# EAGLE design amica (EAGLE 7.6.0)
PROJECT_NAME: AmiCA USB-PD power supply
Assembly variants: LaptopPack, USB-PD
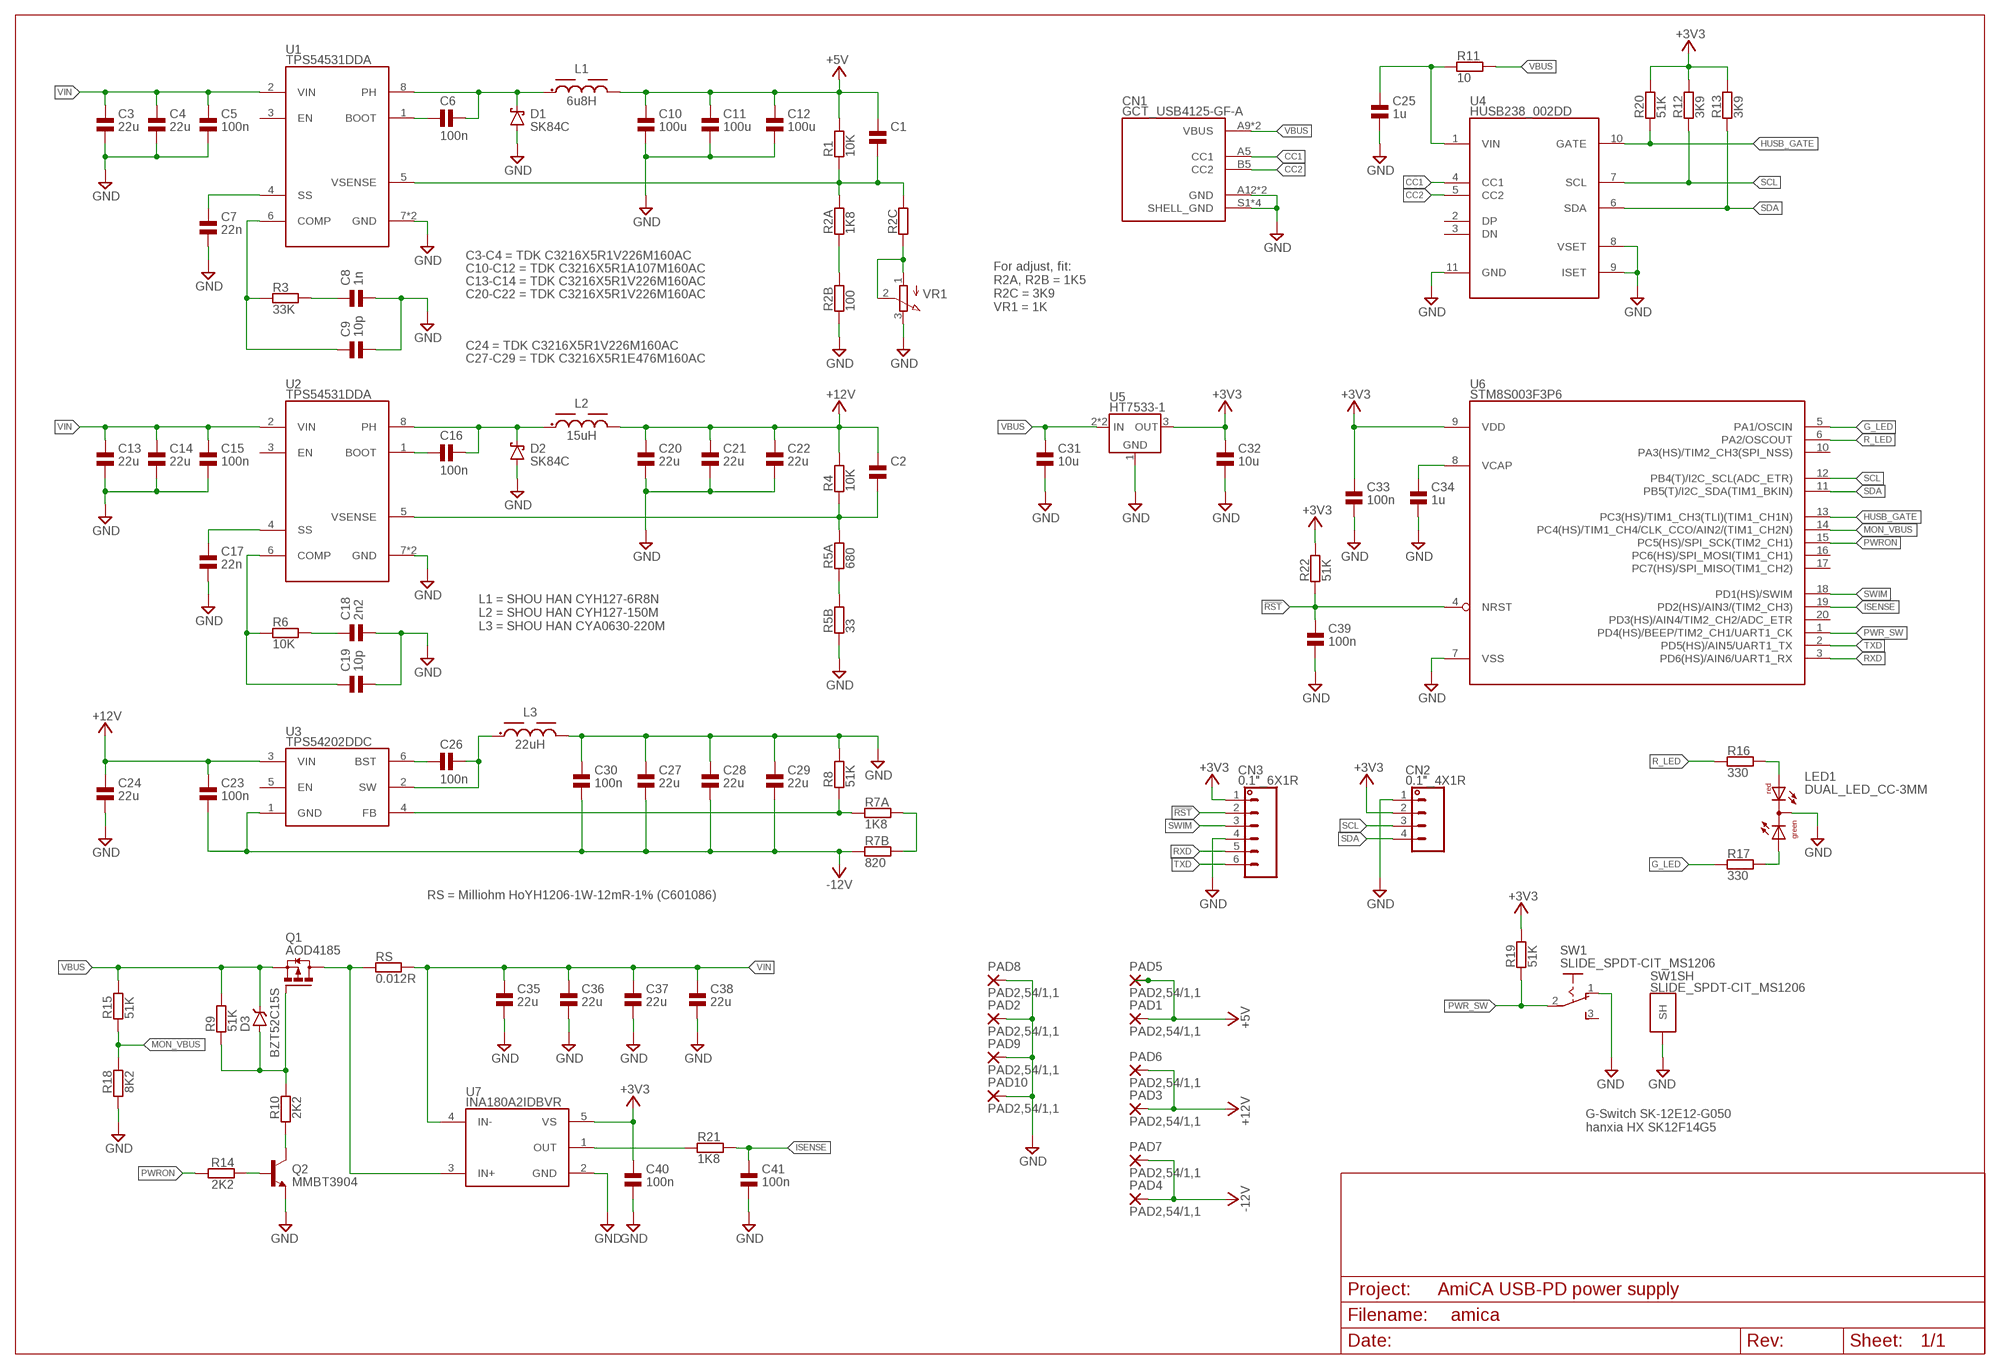
[diagram p0: schematic, sheet 1]

## Parts
C1  CAP_NPOL-0603  [0603]
C2  CAP_NPOL-0603  [0603]
C3  22u  CAP_NPOL-1206  [1206]
C4  22u  CAP_NPOL-1206  [1206]
C5  100n  CAP_NPOL-0603  [0603]
C6  100n  CAP_NPOL-0603  [0603]
C7  22n  CAP_NPOL-0603  [0603]
C8  1n  CAP_NPOL-0603  [0603]
C9  10p  CAP_NPOL-0603  [0603]
C10  100u  CAP_NPOL-1206  [1206]
C11  100u  CAP_NPOL-1206  [1206]
C12  100u  CAP_NPOL-1206  [1206]
C13  22u  CAP_NPOL-1206  [1206]
C14  22u  CAP_NPOL-1206  [1206]
C15  100n  CAP_NPOL-0603  [0603]
C16  100n  CAP_NPOL-0603  [0603]
C17  22n  CAP_NPOL-0603  [0603]
C18  2n2  CAP_NPOL-0603  [0603]
C19  10p  CAP_NPOL-0603  [0603]
C20  22u  CAP_NPOL-1206  [1206]
C21  22u  CAP_NPOL-1206  [1206]
C22  22u  CAP_NPOL-1206  [1206]
C23  100n  CAP_NPOL-0603  [0603]
C24  22u  CAP_NPOL-1206  [1206]
C25  1u  CAP_NPOL-0603  [0603]  (not fitted in variant LaptopPack)
C26  100n  CAP_NPOL-0603  [0603]
C27  22u  CAP_NPOL-1206  [1206]
C28  22u  CAP_NPOL-1206  [1206]
C29  22u  CAP_NPOL-1206  [1206]
C30  100n  CAP_NPOL-0603  [0603]
C31  10u  CAP_NPOL-0805  [0805]
C32  10u  CAP_NPOL-0603  [0603]
C33  100n  CAP_NPOL-0603  [0603]
C34  1u  CAP_NPOL-0603  [0603]
C35  22u  CAP_NPOL-1206  [1206]
C36  22u  CAP_NPOL-1206  [1206]
C37  22u  CAP_NPOL-1206  [1206]
C38  22u  CAP_NPOL-1206  [1206]
C39  100n  CAP_NPOL-0603  [0603]
C40  100n  CAP_NPOL-0603  [0603]
C41  100n  CAP_NPOL-0603  [0603]
CN1  GCT_USB4125-GF-A  USB-C-6P_GCT_USB4125-GF-A  [GCT_USB4125-GF-A-0190_REVA2]
CN2  0.1"_4X1R  [0.1"_4X1-ROUND]
CN3  0.1"_6X1R  [0.1"_6X1-ROUND]
D1  SK84C  -SHOTTKY_SMC  [SMC]
D2  SK84C  -SHOTTKY_SMC  [SMC]
D3  BZT52C15S  -ZENER_SOD323F  [SOD323F]
L1  6u8H  L-SHOUHAN_CYH125  [SHOUHAN_CYH125]
L2  15uH  L-SHOUHAN_CYH125  [SHOUHAN_CYH125]
L3  22uH  L-SHOUHAN_CYA0630  [SHOUHAN_CYA0630]
LED1  DUAL_LED_CC-3MM  [DUOLED-3MM]
PAD1  PAD2,54/1,1  [2,54/1,1]
PAD2  PAD2,54/1,1  [2,54/1,1]
PAD3  PAD2,54/1,1  [2,54/1,1]
PAD4  PAD2,54/1,1  [2,54/1,1]
PAD5  PAD2,54/1,1  [2,54/1,1]
PAD6  PAD2,54/1,1  [2,54/1,1]
PAD7  PAD2,54/1,1  [2,54/1,1]
PAD8  PAD2,54/1,1  [2,54/1,1]
PAD9  PAD2,54/1,1  [2,54/1,1]
PAD10  PAD2,54/1,1  [2,54/1,1]
Q1  AOD4185  -PMOS_DPAK  [DPAK]
Q2  MMBT3904  -NPN_SOT23  [SOT23]
R1  10K  RES-SMD_0603  [0603]
R2A  1K8  RES-SMD_0603  [0603]
R2B  100  RES-SMD_0603  [0603]
R2C  RES-SMD_0603  [0603]
R3  33K  RES-SMD_0603  [0603]
R4  10K  RES-SMD_0603  [0603]
R5A  680  RES-SMD_0603  [0603]
R5B  33  RES-SMD_0603  [0603]
R6  10K  RES-SMD_0603  [0603]
R7A  1K8  RES-SMD_0603  [0603]
R7B  820  RES-SMD_0603  [0603]
R8  51K  RES-SMD_0603  [0603]
R9  51K  RES-SMD_0603  [0603]
R10  2K2  RES-SMD_0603  [0603]
R11  10  RES-SMD_0805  [0805]  (not fitted in variant LaptopPack)
R12  3K9  RES-SMD_0603  [0603]
R13  3K9  RES-SMD_0603  [0603]
R14  2K2  RES-SMD_0603  [0603]
R15  51K  RES-SMD_0603  [0603]
R16  330  RES-SMD_0603  [0603]
R17  330  RES-SMD_0603  [0603]
R18  8K2  RES-SMD_0603  [0603]
R19  51K  RES-SMD_0603  [0603]
R20  51K  RES-SMD_0603  [0603]
R21  1K8  RES-SMD_0603  [0603]
R22  51K  RES-SMD_0603  [0603]
RS  0.012R  RES-SMD_1206  [1206]
SW1  SLIDE_SPDT-CIT_MS1206  [CIT_MS1206]
U1  TPS54531DDA  [SO08-EP]
U2  TPS54531DDA  [SO08-EP]
U3  TPS54202DDC  [SOT23-6]
U4  HUSB238_002DD  [DFN10-3X3]  (not fitted in variant LaptopPack)
U5  HT7533-1  [SOT89]
U6  STM8S003F3P6  [TSSOP20]
U7  INA180A2IDBVR  INA180A2DBV  [SOT23-5]
VR1  TRIMMER-BOURNS_3362P  [TRIM_3362P-1]

## Nets
5V_BST: C6.1 U1.1(BOOT)
5V_COMP: C9.1 R3.1 U1.6(COMP)
5V_FB: C1.2 R1.1 R2A.2 R2C.2 U1.5(VSENSE)
5V_SS: C7.1 U1.4(SS)
5V_SW: C6.2 D1.K(C) L1.P$1 U1.8(PH)
12V_BST: C16.1 U2.1(BOOT)
12V_COMP: C19.1 R6.1 U2.6(COMP)
12V_FB: C2.2 R4.1 R5A.2 U2.5(VSENSE)
12V_SS: C17.1 U2.4(SS)
12V_SW: C16.2 D2.K(C) L2.P$1 U2.8(PH)
!RST: C39.1 CN3.2 R22.1 U6.4(NRST)
+3V3: C32.1 C33.1 C40.1 CN2.2 CN3.1 R12.2 R13.2 R19.2 R20.2 R22.2 U5.3(OUT) U6.9(VDD) U7.5(VS)
+5V: C1.1 C10.1 C11.1 C12.1 L1.P$2 PAD1.1(P) PAD5.1(P) R1.2
+12V: C2.1 C20.1 C21.1 C22.1 C23.1 C24.1 L2.P$2 PAD3.1(P) PAD6.1(P) R4.2 U3.3(VIN)
-12V: C23.2 C27.2 C28.2 C29.2 C30.2 PAD4.1(P) PAD7.1(P) R7B.1 U3.1(GND)
-12V_BST: C26.1 U3.6(BST)
-12V_FB: R7A.1 R8.1 U3.4(FB)
-12V_SW: C26.2 L3.P$1 U3.2(SW)
CC1: CN1.A5(CC1) U4.4(CC1)
CC2: CN1.B5(CC2) U4.5(CC2)
G_LED: R17.1 U6.5(PA1/OSCIN)
GND: C3.2 C4.2 C5.2 C7.2 C8.2 C9.2 C10.2 C11.2 C12.2 C13.2 C14.2 C15.2 C17.2 C18.2 C19.2 C20.2 C21.2 C22.2 C24.2 C25.2 C27.1 C28.1 C29.1 C30.1 C31.2 C32.2 C33.2 C34.2 C35.2 C36.2 C37.2 C38.2 C39.2 C40.2 C41.2 CN1.A12(GND) CN1.B12(GND) CN1.S1(SHELL_GND) CN1.S2(SHELL_GND) CN1.S3(SHELL_GND) CN1.S4(SHELL_GND) CN2.1 CN3.4 D1.A D2.A L3.P$2 LED1.COM(C) PAD2.1(P) PAD8.1(P) PAD9.1(P) PAD10.1(P) Q2.2(E) R2B.1 R5B.1 R8.2 R18.2 SW1.1(O) SW1.GND@1(SH) SW1.GND@2(SH) U1.7(GND) U1.PAD(GND) U2.7(GND) U2.PAD(GND) U4.8(VSET) U4.9(ISET) U4.11(GND) U5.1(GND) U6.7(VSS) U7.2(GND) VR1.3(CW)
HUSB_GATE: R20.1 U4.10(GATE) U6.13(PC3(HS)/TIM1_CH3(TLI)(TIM1_CH1N))
HUSB_VIN: C25.1 R11.1 U4.1(VIN)
ISENSE: C41.1 R21.2 U6.19(PD2(HS)/AIN3/(TIM2_CH3))
MON_VBUS: R15.1 R18.1 U6.14(PC4(HS)/TIM1_CH4/CLK_CCO/AIN2/(TIM1_CH2N))
N$1: D3.A Q1.1(G) R9.1 R10.1
N$2: LED1.2(AR) R16.2
N$3: R2A.1 R2B.2
N$4: R2C.1 VR1.1(CCW) VR1.2(W)
N$5: C18.1 R6.2
N$6: C34.1 U6.8(VCAP)
N$7: LED1.1(AG) R17.2
N$8: Q2.1(B) R14.1
N$9: R5A.1 R5B.2
N$10: C8.1 R3.2
N$11: R21.1 U7.1(OUT)
N$12: R7A.2 R7B.2
N$13: Q2.3(C) R10.2
PWR_SW: R19.1 SW1.2(P) U6.1(PD4(HS)/BEEP/TIM2_CH1/UART1_CK)
PWRON: R14.2 U6.15(PC5(HS)/SPI_SCK(TIM2_CH1))
R_LED: R16.1 U6.6(PA2/OSCOUT)
RXD: CN3.5 U6.3(PD6(HS)/AIN6/UART1_RX)
SCL: CN2.3 R12.1 U4.7(SCL) U6.12(PB4(T)/I2C_SCL(ADC_ETR))
SDA: CN2.4 R13.1 U4.6(SDA) U6.11(PB5(T)/I2C_SDA(TIM1_BKIN))
SWIM: CN3.3 U6.18(PD1(HS)/SWIM)
TXD: CN3.6 U6.2(PD5(HS)/AIN5/UART1_TX)
VBUS: C31.1 CN1.A9(VBUS) CN1.B9(VBUS) D3.C Q1.3(S) R9.2 R11.2 R15.2 U5.2(IN) U5.2@1(IN)
VBUS_SW: Q1.4(D) RS.1 U7.3(IN+)
VIN: C3.1 C4.1 C5.1 C13.1 C14.1 C15.1 C35.1 C36.1 C37.1 C38.1 RS.2 U1.2(VIN) U2.2(VIN) U7.4(IN-)
Unconnected: SW1.3(S) U1.3(EN) U2.3(EN) U3.5(EN) U4.2(DP) U4.3(DN) U6.10(PA3(HS)/TIM2_CH3(SPI_NSS)) U6.16(PC6(HS)/SPI_MOSI(TIM1_CH1)) U6.17(PC7(HS)/SPI_MISO(TIM1_CH2)) U6.20(PD3(HS)/AIN4/TIM2_CH2/ADC_ETR)

## Notes on the sheet
- C3-C4 = TDK C3216X5R1V226M160AC
- C10-C12 = TDK C3216X5R1A107M160AC
- C13-C14 = TDK C3216X5R1V226M160AC
- C20-C22 = TDK C3216X5R1V226M160AC
- For adjust, fit:
  R2A, R2B = 1K5
  R2C = 3K9
  VR1 = 1K
- C24 = TDK C3216X5R1V226M160AC
- C27-C29 = TDK C3216X5R1E476M160AC
- L1 = SHOU HAN CYH127-6R8N
  L2 = SHOU HAN CYH127-150M
  L3 = SHOU HAN CYA0630-220M
- RS = Milliohm HoYH1206-1W-12mR-1% (C601086)
- G-Switch SK-12E12-G050
  hanxia HX SK12F14G5

## Library data of the parts
C1 C2 = jc-passive:CAP_NPOL
C3 C4 C13 C14 C20-C22 C24 C27-C29 C35-C38 = jc-passive:CAP_NPOL; LCSC_PART: C12891
C5 C6 C15 C16 C23 C26 C30 C33 C39-C41 = jc-passive:CAP_NPOL; LCSC_PART: C14663
C7 C17 = jc-passive:CAP_NPOL; LCSC_PART: C21122
C8 = jc-passive:CAP_NPOL; LCSC_PART: C1588
C9 C19 = jc-passive:CAP_NPOL; LCSC_PART: C1634
C10-C12 = jc-passive:CAP_NPOL; LCSC_PART: C15008
C18 = jc-passive:CAP_NPOL; LCSC_PART: C1604
C25 C34 = jc-passive:CAP_NPOL; LCSC_PART: C15849
C31 = jc-passive:CAP_NPOL; LCSC_PART: C15850
C32 = jc-passive:CAP_NPOL; LCSC_PART: C19702
CN1 = jc-connectors:USB-C-6P_; LCSC_PART: C18357552
CN2 = jc-connectors:0.1"_4X1
CN3 = jc-connectors:0.1"_6X1
D1 D2 = jc-discretesemi:*-SHOTTKY_?; LCSC_PART: C28646293
D3 = jc-discretesemi:*-ZENER_?; LCSC_PART: C19077448
L1 = jc-inductors:L; LCSC_PART: C2929498
L2 = jc-inductors:L; LCSC_PART: C2929500
L3 = jc-inductors:L; LCSC_PART: C5189960
LED1 = jc-led:DUAL_LED_CC
PAD1-PAD10 = jc-connectors:PAD: Wire PAD connect wire on PCB
Q1 = jc-discretesemi:*-PMOS_?; LCSC_PART: C400894
Q2 = jc-discretesemi:*-NPN_?; LCSC_PART: C7420353
R1 R4 R6 = jc-passive:RES; LCSC_PART: C25804
R2A R7A R21 = jc-passive:RES; LCSC_PART: C4177
R2B = jc-passive:RES; LCSC_PART: C22775
R2C = jc-passive:RES
R3 = jc-passive:RES; LCSC_PART: C4216
R5A = jc-passive:RES; LCSC_PART: C23228
R5B = jc-passive:RES; LCSC_PART: C23140
R7B = jc-passive:RES; LCSC_PART: C23253
R8 R9 R15 R19 R20 R22 = jc-passive:RES; LCSC_PART: C23196
R10 R14 = jc-passive:RES; LCSC_PART: C4190
R11 = jc-passive:RES; LCSC_PART: C17415
R12 R13 = jc-passive:RES; LCSC_PART: C23018
R16 R17 = jc-passive:RES; LCSC_PART: C23138
R18 = jc-passive:RES; LCSC_PART: C25981
RS = jc-passive:RES; LCSC_PART: C601086
SW1 = jc-switches:SLIDE_SPDT; LCSC_PART: C2848870
U1 U2 = jc-vreg:TPS54531: TPS54531 5-A, 28-V Input, SWIFT™ Step-Down Converter With Eco-mode Datasheet <https://www.ti.com/lit/ds/symlink/tps54531.pdf>; LCSC_PART: C50605
U3 = jc-vreg:TPS54202: TPS54202 4.5-V to 28-V Input, 2-A Output, EMI Friendly Synchronous Step Down Converter Datasheet <https://www.ti.com/lit/ds/symlink/tps54202.pdf>; LCSC_PART: C191884
U4 = jc-ic:HUSB238; LCSC_PART: C7471904
U5 = jc-vreg:HT75*-1; LCSC_PART: C14289
U6 = jc-stm8:STM8S003F3?6: Check availability <https://pricing.snapeda.com/parts/STM8S003F3P6/STMicroelectronics/view-part?ref=eda>; LCSC_PART: C52717
U7 = jc-ic:INA180A; LCSC_PART: C192764
VR1 = jc-potentiometer:TRIMMER

## Board
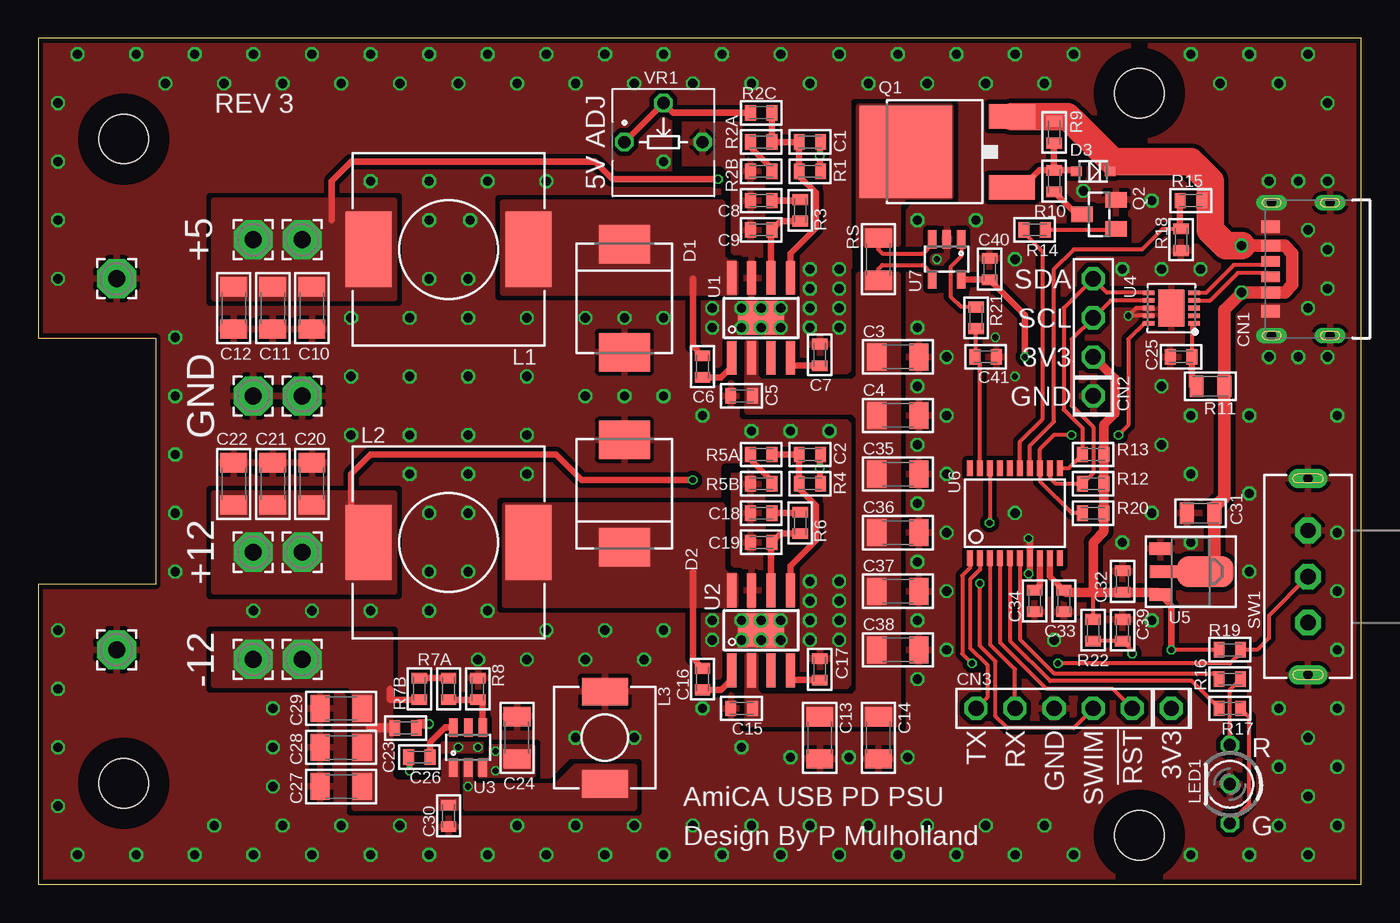
[diagram p1: board, top side]
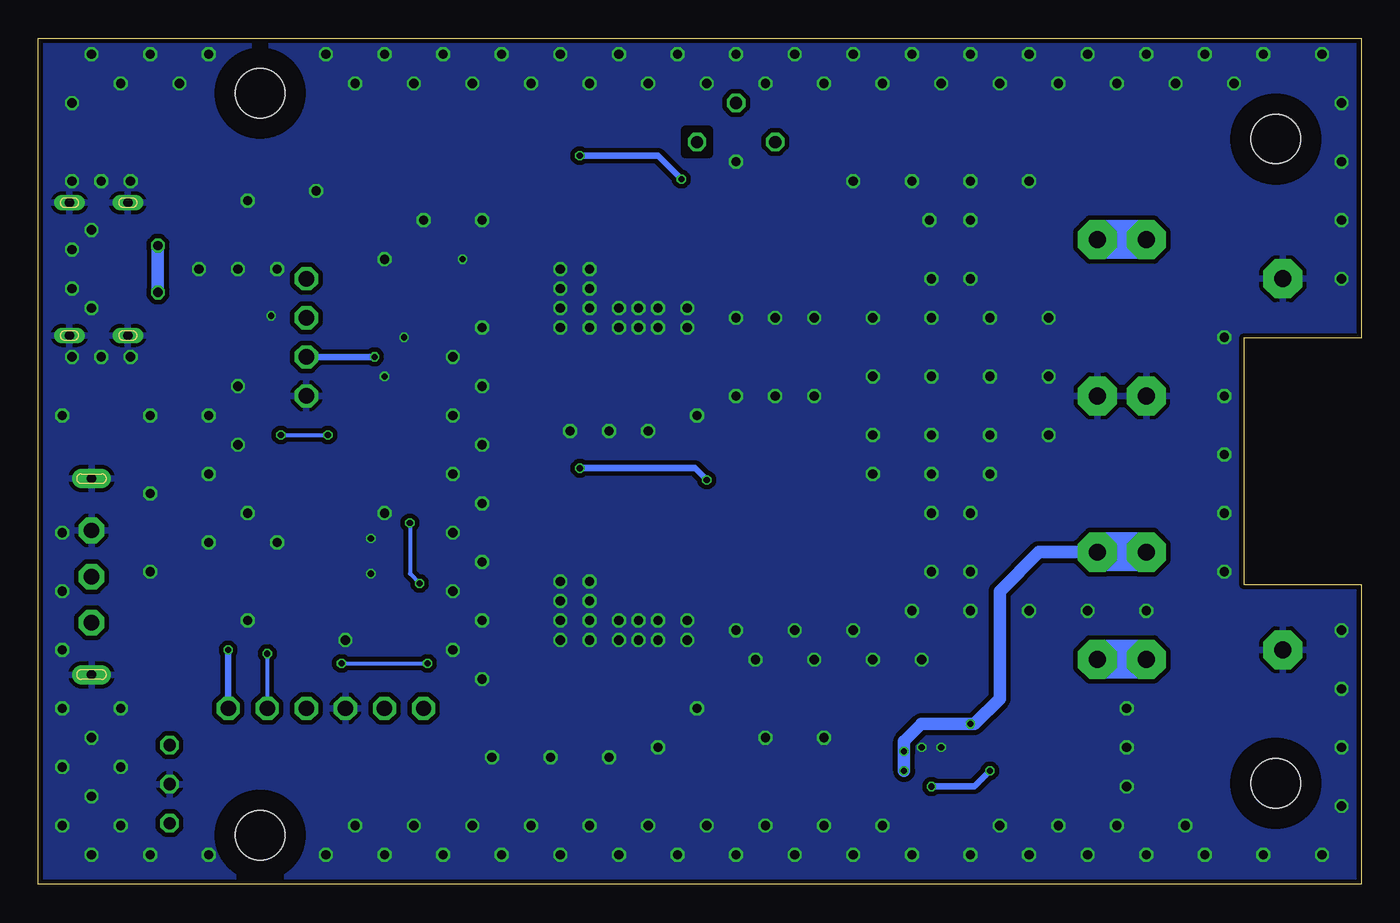
[diagram p2: board, bottom side, seen from below]

Size 86 x 55 mm. Coordinates in mm from the lower left corner, seen from the top.
Outline: 0,0 86,0 86,55 0,55 0,35.5 7.62,35.5 7.62,19.5 0,19.5 0,0
Copper layers (1*16): Top 0.035mm / dielectric 0.2mm / Bottom 0.035mm
Design rules "jlcpcb-2layers": minimum track width 3.5mil, minimum drill 0.2mm, track to track 5mil, track to pad 5mil, pad to pad 5mil, via to via 5mil, smd to smd 0mil, copper to edge 0.1mm, drill to drill 5mil, minimum pad ring 4mil, minimum via ring 4mil, stop-mask expansion 3mil, vias tented up to drill 100mil, thermal gap 10mil
Holes 3.2 mm at 5.54,48.46 5.54,6.55 71.58,51.44 71.58,3.18
tRestrict: area 2.9,3.9 to 8.2,9.2; area 2.9,45.8 to 8.2,51.1; area 68.9,0.5 to 74.2,5.8; area 68.9,48.8 to 74.2,54.1; 8 lines
bRestrict: area 2.9,3.9 to 8.2,9.2; area 2.9,45.8 to 8.2,51.1; area 68.9,0.5 to 74.2,5.8; area 68.9,48.8 to 74.2,54.1; 4 lines

### Footprints (pad centres in the part's own frame; a part is rotated, then mirrored left to right if it is on the bottom)
0603 = smd 0.7 x 1: 1 -0.7,0; 2 0.7,0
1206 = smd 1.25 x 1.75: 1 -1.375,0; 2 1.375,0
0805 = smd 0.9 x 1.4: 1 -0.9,0; 2 0.9,0
GCT_USB4125-GF-A-0190_REVA2 = smd 0.7 x 1.2: A5 -0.5,3.08; B5 0.5,3.08 | smd 0.76 x 1.2: A9 1.52,3.08; B9 -1.52,3.08 | smd 0.8 x 1.2: A12 2.75,3.08; B12 -2.75,3.08 | drill 0.6 pad 1 long: S1 -4.32,3; S2 4.32,3; S3 -4.32,-0.8; S4 4.32,-0.8
0.1"_4X1-ROUND = drill 1 octagon: 1 -3.81,0; 2 -1.27,0; 3 1.27,0; 4 3.81,0
0.1"_6X1-ROUND = drill 1 octagon: 1 -6.35,0; 2 -3.81,0; 3 -1.27,0; 4 1.27,0; 5 3.81,0; 6 6.35,0
SMC = smd 2.5 x 3.3: A 3.5,0; K -3.5,0
SOD323F = smd 0.7 x 0.6: A 1.1,0; C -1.1,0
SHOUHAN_CYH125 = smd 3 x 4.9: P$1 -5.2,0; P$2 5.2,0
SHOUHAN_CYA0630 = smd 1.8 x 3: P$1 -3,0; P$2 3,0
DUOLED-3MM = drill 0.8 octagon: 1 -2.54,0; 2 2.54,0; COM 0,0
2,54/1,1 = drill 1.1 pad 2.54 octagon: 1 0,0
DPAK = smd 3 x 1.6: 1 3.598,-2.3; 3 3.598,2.3 | smd 6 x 6: 4 -3.302,0
SOT23 = smd 1 x 1.4: 1 -0.95,-1.1; 2 0.95,-1.1; 3 0,1.1
CIT_MS1206 = drill 1 pad 1.676 octagon: 1 3,0; 2 0,0; 3 -3,0 | drill 0.6 pad 1.27 long: GND@1 6.375,0; GND@2 -6.375,0
SO08-EP = smd 0.6 x 2.2: 1 -1.905,-2.6; 2 -0.635,-2.6; 3 0.635,-2.6; 4 1.905,-2.6; 5 1.905,2.6; 6 0.635,2.6; 7 -0.635,2.6; 8 -1.905,2.6 | smd 3 x 2.2: PAD 0,0
SOT23-6 = smd 0.55 x 1.2: 1 -0.95,-1.3; 2 0,-1.3; 3 0.95,-1.3; 4 0.95,1.3; 5 0,1.3; 6 -0.95,1.3
DFN10-3X3 = smd 0.74 x 0.3: 1 -1.475,1; 2 -1.475,0.5; 3 -1.475,0; 4 -1.475,-0.5; 5 -1.475,-1; 6 1.475,-1; 7 1.475,-0.5; 8 1.475,0; 9 1.475,0.5; 10 1.475,1 | smd 1.7 x 2.4: 11 0,0
SOT89 = smd 1.4 x 0.8: 1 1.727,-1.499; 3 1.727,1.499 | smd 1.9 x 0.8: 2 1.473,0 | smd 3.65 x 2.032: 2@1 -1.194,0
TSSOP20 = smd 0.4 x 1: 1 -2.925,-2.925; 2 -2.275,-2.925; 3 -1.625,-2.925; 4 -0.975,-2.925; 5 -0.325,-2.925; 6 0.325,-2.925; 7 0.975,-2.925; 8 1.625,-2.925; 9 2.275,-2.925; 10 2.925,-2.925; 11 2.925,2.925; 12 2.275,2.925; 13 1.625,2.925; 14 0.975,2.925; 15 0.325,2.925; 16 -0.325,2.925; 17 -0.975,2.925; 18 -1.625,2.925; 19 -2.275,2.925; 20 -2.925,2.925
SOT23-5 = smd 0.55 x 1.2: 1 -0.95,-1.3; 2 0,-1.3; 3 0.95,-1.3; 4 0.95,1.3; 5 -0.95,1.3
TRIM_3362P-1 = drill 0.8 octagon: 1 -2.54,0; 2 0,2.54; 3 2.54,0

### Placement (x,y rotation side)
C1  50.16,48.26 180 top
C2  50.16,27.94 180 top
C3  55.88,34.29 0 top
C4  55.88,30.48 0 top
C5  45.72,31.75 180 top
C6  43.18,33.66 90 top
C7  50.8,34.42 90 top
C8  46.99,44.45 180 top
C9  46.99,42.55 180 top
C10  17.78,37.47 270 top
C11  15.24,37.47 270 top
C12  12.7,37.47 270 top
C13  50.8,9.53 270 top
C14  54.61,9.53 270 top
C15  45.72,11.43 180 top
C16  43.18,13.34 90 top
C17  50.8,13.97 90 top
C18  46.99,24.13 180 top
C19  46.99,22.23 180 top
C20  17.78,26.04 90 top
C21  15.24,26.04 90 top
C22  12.7,26.04 90 top
C23  23.88,10.16 180 top
C24  31.11,9.53 90 top
C25  74.3,34.29 180 top
C26  24.77,8.26 180 top
C27  19.68,6.35 0 top
C28  19.68,8.89 0 top
C29  19.68,11.43 0 top
C30  26.67,4.45 90 top
C31  75.56,24.13 180 top
C32  70.48,19.68 90 top
C33  66.67,18.41 270 top
C34  64.77,18.41 270 top
C35  55.88,26.67 0 top
C36  55.88,22.86 0 top
C37  55.88,19.05 0 top
C38  55.88,15.24 0 top
C39  70.48,16.51 90 top
C40  61.85,40.01 90 top
C41  61.59,34.29 0 top
CN1  83.19,40 90 top
CN2  68.58,35.56 90 top
CN3  67.31,11.43 180 top
D1  38.1,38.1 270 top
D2  38.1,25.4 90 top
D3  68.58,46.35 180 top
L1  26.67,41.27 180 top
L2  26.67,22.23 180 top
L3  36.83,9.53 90 top
LED1  77.47,6.5 90 top
PAD1  13.97,41.91 90 top
PAD2  13.97,31.75 90 top
PAD3  13.97,21.59 90 top
PAD4  13.97,14.61 90 top
PAD5  17.14,41.91 0 top
PAD6  17.14,21.59 0 top
PAD7  17.14,14.61 0 top
PAD8  17.14,31.75 0 top
PAD9  5.08,39.37 0 top
PAD10  5.08,15.24 0 top
Q1  59.69,47.62 0 top
Q2  68.96,43.56 90 top
R1  50.16,46.35 0 top
R2A  46.99,48.26 0 top
R2B  46.99,46.35 0 top
R2C  46.99,50.16 0 top
R3  49.53,43.81 90 top
R4  50.16,26.04 0 top
R5A  46.99,27.94 0 top
R5B  46.99,26.04 0 top
R6  49.53,23.5 90 top
R7A  26.67,12.7 90 top
R7B  24.77,12.7 90 top
R8  28.57,12.7 90 top
R9  66.04,48.9 90 top
R10  66.04,45.72 270 top
R11  76.2,32.38 0 top
R12  68.58,26.04 0 top
R13  68.58,27.94 0 top
R14  64.77,42.55 180 top
R15  74.93,44.45 0 top
R16  77.47,13.34 0 top
R17  77.47,11.43 0 top
R18  74.3,41.91 270 top
R19  77.47,15.24 180 top
R20  68.58,24.13 0 top
R21  60.96,36.83 270 top
R22  68.58,16.51 90 top
RS  54.61,40.64 270 top
SW1  82.55,20 90 top
U1  46.99,36.83 0 top
U2  46.99,16.51 0 top
U3  27.94,8.89 0 top
U4  73.66,37.47 180 top
U5  74.68,20.32 180 top
U6  63.5,24.13 0 top
U7  59.05,40.64 180 top
VR1  40.64,48.26 0 top

### Tracks (layer width: path | path; a pad name or v marks a point on that pad's centre or on a via)
5V_BST
  Top 0.406: U1.1 45.09,33.66 44.38,32.95 C6.1
5V_COMP
  Top 0.406: U1.6 47.62,42.55 C9.1 48.26,43.12 R3.1
5V_FB
  Top 0.406: R2C.2 R2A.2 C1.2 R1.1 49.47,46.04 50.55,44.96 50.55,42.67 48.9,41.02 U1.5
5V_SS
  Top 0.406: U1.4 48.9,33.72 C7.1
5V_SW
  Top 0.406: C6.2 42.55,34.99 42.55,39.37
  pour Top (no thermals): 45.34,38.48 30.23,38.48 30.23,44.32 44.45,44.32 44.45,40.77 44.83,40.39 45.34,40.39
12V_BST
  Top 0.406: U2.1 45.09,13.34 44.38,12.63 C16.1
12V_COMP
  Top 0.406: U2.6 47.62,22.23 C19.1 48.26,22.8 R6.1
12V_FB
  Top 0.406: U2.5 48.9,20.7 50.55,22.35 50.55,24.64 49.47,25.72 R4.1 C2.2 R5A.2
12V_SS
  Top 0.406: U2.4 48.9,13.27 C17.1
12V_SW
  Top 0.406: C16.2 42.55,14.67 42.55,20.32
  pour Top (no thermals): 45.34,18.16 30.35,18.16 30.35,24.64 44.45,24.64 44.45,20.45 44.83,20.07 45.34,20.07
!RST  (via drill 0.4)
  Top 0.254: U6.4 62.52,15.71 65.53,12.7 69.85,12.7 CN3.2 | v71.12,14.99 71.12,15.18 C39.1 R22.1
  Bottom 0.254: v71.12,14.99 CN3.2
+3V3  (via drill 0.4, 0.4 pad 0.41)
  Top 0.254: R19.2 v73.66,15.24 | R22.2 68.58,18.98
  Top 0.406: U6.9 65.78,20.02 C33.1 | v73.66,15.24 73.66,18.11 U5.3 | v64.14,34.29 64.14,37.02 C40.1 60.01,39.3 U7.5
  Top 0.61: U5.3 72.78,18.98 C32.1 68.58,18.98 | C33.1 66.81,18.98 68.58,18.98 | CN2.2 69.98,32.89 69.98,30.6 69.28,29.91 R13.2 R12.2 R20.2 69.28,22.93 68.58,22.23 68.58,18.98
  Bottom 0.406: CN3.1 v73.66,15.24 | CN2.2 v64.14,34.29
+5V  (via drill 0.4)
  Top 0.406: R1.2 50.8,46.42 v50.8,47.37 50.8,48.26 C1.1 | v44.2,45.85 37.34,45.85 36.2,46.99 20.32,46.99 19.05,45.72 19.05,43.18
  Bottom 0.406: v50.8,47.37 45.72,47.37 v44.2,45.85
  Bottom 2.54: PAD1.1 PAD5.1
  pour Top (no thermals): 23.11,44.45 23.11,38.1 11.43,38.1 11.43,44.45
+12V  (via drill 0.4)
  Top 0.406: R4.2 50.8,26.04 v50.8,27.05 50.8,27.94 C2.1 | v42.55,26.29 35.31,26.29 33.66,27.94 21.59,27.94 20.32,26.67 20.32,24.13
  Top 0.61: C23.1 24.58,10.22 24.77,10.41 v25.4,10.41
  Bottom 0.406: v50.8,27.05 43.31,27.05 v42.55,26.29
  Bottom 0.813: PAD6.1 20.95,21.59 23.5,19.05 23.5,12.06 25.15,10.41 v25.4,10.41 28.57,10.41 29.72,9.27 v29.72,8.64 v29.72,7.37
  Bottom 2.54: PAD3.1 PAD6.1
  pour Top (no thermals): 23.11,25.4 23.11,19.05 11.43,19.05 11.43,25.4
  pour Top (no thermals): 32.13,7.11 28.7,7.11 28.7,8 29.21,8 29.46,8.26 29.46,8.89 32.13,8.89
-12V
  Top 0.406: R7B.1 22.86,12 22.86,12.7
  Top 0.61: C23.2 21.59,10.16
  Bottom 2.54: PAD4.1 PAD7.1
  pour Top (no thermals): 27.18,8 26.42,8 26.42,6.99 26.04,6.6 23.24,6.6 22.86,6.99 22.86,16.26 11.43,16.26 11.43,12.95 20.19,12.95 20.57,12.57 20.57,4.95 27.18,4.95
-12V_BST
  Top 0.406: U3.6 26.45,10.19 25.46,9.21 C26.1
-12V_FB
  Top 0.406: R8.1 28.57,12.06 | R7A.1 R8.1 | U3.4 28.89,11.69 R8.1
-12V_SW  (via drill 0.4)
  Top 0.406: C26.2 24.13,8.26 v24.13,7.37
  Bottom 0.406: 27.94,6.32 v27.94,6.35 25.15,6.35 v24.13,7.37
  pour Top (no thermals): 38.73,4.95 27.81,4.95 27.81,8 28.07,8 28.07,6.73 28.45,6.35 33.66,6.35 34.92,7.62 38.73,7.62
CC1
  Top 0.254: U4.4 76.19,37.97 77.98,39.75 79.85,39.75 CN1.A5
CC2
  Top 0.254: U4.5 75.93,38.47 77.72,40.26 79.86,40.26 CN1.B5
G_LED
  Top 0.254: U6.5 63.17,15.82 65.79,13.21 74.99,13.21 R17.1
GND  (via drill 0.4, 0.6)
  Top 0.254: U4.8 71.37,37.47 v70.87,36.97 | U4.9 v70.87,36.97 | v70.87,36.97 v70.87,36.96
  Top 0.406: v64.39,22.48 64.47,22.48 U6.7 64.47,20.19 | 64.47,20.19 | 64.47,20.19 v64.39,20.19
  other vias: 48.26,36.2 46.99,36.2 45.72,36.2 48.26,37.47 46.99,37.47 45.72,37.47 43.81,36.2 43.81,37.47 50.16,36.2 40.64,36.83 38.1,36.83 35.56,36.83 48.26,15.88 46.99,15.88 45.72,15.88 45.72,17.14 46.99,17.14 48.26,17.14 50.16,19.68 43.81,17.14 43.81,15.88 50.16,15.88 35.56,31.75 40.64,31.75 31.75,29.21 31.75,26.67 31.75,33.02 27.94,29.21 24.13,29.21 27.94,33.02 24.13,33.02 36.83,16.51 33.02,16.51 29.21,17.78 39.37,14.61 35.56,14.61 31.75,14.61 28.57,14.61 38.73,9.53 34.92,9.53 15.24,11.43 15.24,8.89 50.16,17.14 50.16,37.47 20.32,33.02 20.32,29.21 27.94,39.37 25.4,39.37 25.4,43.18 28.07,43.18 25.4,20.32 25.4,24.13 25.4,17.78 27.94,20.32 27.94,24.13 66.04,15.88 1.27,43.18 1.27,39.37 1.27,16.51 1.27,12.7 1.27,8.89 2.54,1.91 6.35,1.91 10.16,1.91 13.97,1.91 17.78,1.91 21.59,1.91 25.4,1.91 29.21,1.91 33.02,1.91 36.83,1.91 40.64,1.91 44.45,1.91 48.26,1.91 52.07,1.91 55.88,1.91 59.69,1.91 63.5,1.91 67.31,1.91 1.27,5.08 1.27,46.99 1.27,50.8 2.54,53.98 6.35,53.98 10.16,53.98 13.97,53.98 17.78,53.98 21.59,53.98 25.4,53.98 29.21,53.98 33.02,53.98 36.83,53.98 40.64,53.98 44.45,53.98 48.26,53.98 52.07,53.98 55.88,53.98 59.69,53.98 63.5,53.98 67.31,53.98 74.93,1.91 78.74,1.91 82.55,1.91 74.93,53.98 78.74,53.98 82.55,53.98 83.82,50.8 27.3,8.89 28.57,8.89 15.24,6.35 11.43,3.81 15.88,3.81 19.68,3.81 31.11,3.81 34.92,3.81 38.73,3.81 21.59,17.78 13.97,17.78 27.94,36.83 20.32,36.83 24.13,36.83 31.75,36.83 27.94,26.67 24.13,26.67 21.59,45.72 25.4,45.72 29.21,45.72 33.02,45.72 8.89,20.32 8.89,24.13 8.89,27.94 8.89,31.75 8.89,35.56 78.74,20.32 12.06,52.07 15.88,52.07 19.68,52.07 23.5,52.07 27.3,52.07 31.11,52.07 34.92,52.07 38.73,52.07 46.35,52.07 50.16,52.07 53.98,52.07 57.78,52.07 61.59,52.07 65.41,52.07 8.26,52.07 42.55,3.81 46.35,3.81 50.16,3.81 53.98,3.81 57.78,3.81 61.59,3.81 65.41,3.81 76.83,52.07 80.64,52.07 17.78,17.78 78.74,25.4 72.39,17.14 43.18,30.48 43.18,11.43 74.93,22.23 23.5,3.81 57.15,17.14 57.15,20.95 57.15,24.77 57.15,28.57 57.15,32.38 57.15,13.34 52.7,8.26 48.9,8.26 56.52,8.26 57.15,36.2 80.64,3.81 84.45,3.81 84.45,7.62 82.55,5.71 80.01,34.29 82.55,42.55 82.55,37.47 83.82,41.27 83.82,38.73 80.01,45.72 83.82,45.72 83.82,34.29 59.05,15.24 59.05,19.05 59.05,22.86 59.05,26.67 59.05,30.48 59.05,34.29 40.64,46.99 81.92,34.29 81.92,45.72 78.74,30.48 84.45,30.48 82.55,9.53 84.45,11.43 80.64,11.43 80.64,7.62 84.45,15.24 84.45,19.05 84.45,22.86 50.16,40.01 67.94,45.09 72.39,44.45 73.03,40.01 75.56,40.01 70.48,40.01 72.39,24.13 70.48,22.23 73.03,32.38 73.03,28.57 74.93,26.67 60.96,43.18 57.15,43.18 58.42,40.64 62.23,35.56 63.5,33.02 63.5,24.13 74.93,30.48 63.5,40.64 42.55,52.07 40.64,16.51 38.1,31.75 52.07,15.88 52.07,17.14 52.07,37.47 52.07,36.2 52.07,40.01 52.07,19.68 50.16,18.41 52.07,18.41 52.07,38.73 50.16,38.73 45.72,8.89 51.44,29.46 48.9,29.46 46.35,29.46
  pour Bottom (isolate 0.305, rank 6): 0,0 86.36,0 86.36,55.88 0,55.88 0,34.29 7.62,34.29 7.62,20.32 0,20.32
  pour Top (isolate 0.305, rank 6): 0,0 86.36,0 86.36,55.88 0,55.88 0,34.29 7.62,34.29 7.62,20.32 0,20.32
  pour Top (isolate 0.254, no thermals): 78.87,45.09 82.55,45.09 82.55,34.8 78.87,34.8
HUSB_GATE  (via drill 0.4 pad 0.41)
  Top 0.254: v70.23,29.21 70.87,29.84 70.87,35.43 71.9,36.47 U4.10 | R20.1 67.18,24.13 65.12,26.19 U6.13 65.12,28.3 66.04,29.21 v67.18,29.21
  Bottom 0.254: v70.23,29.21 v67.18,29.21
HUSB_VIN
  Top 0.254: 75.3,36.47 U4.1 75,36.47 C25.1
  Top 0.406: C25.1 75,32.38 R11.1
ISENSE
  Top 0.254: U6.19 61.23,33.77 60.9,34.1 C41.1 60.96,34.29 R21.2
MON_VBUS
  Top 0.254: U6.14 64.47,28.53 66.04,30.1 66.04,40.01 67.31,41.27 71.75,41.27 73.09,42.61 R18.1
  Top 0.406: R15.1 74.23,42.61 R18.1
N$1
  Top 0.406: R9.1 R10.1 | R10.1 65.09,46.42 64.01,45.34 63.3,45.34 Q1.1 | R10.1 67.42,46.42 D3.A
N$2
  Top 0.254: LED1.2 77.47,12.63 R16.2
N$3
  Top 0.406: R2A.1 46.29,47.94 47.69,46.54 R2B.2
N$4
  Top 0.406: R2C.1 41.27,50.16 VR1.2 VR1.1
N$5
  Top 0.406: C18.1 49.53,24.13 R6.2
N$6
  Top 0.406: U6.8 65.12,19.47 C34.1
N$7
  Top 0.254: R17.2 78.74,10.86 78.74,5.23 LED1.1
N$8
  Top 0.254: Q2.1 70.06,42.55 R14.1
N$9
  Top 0.406: R5A.1 46.29,27.62 47.69,26.22 R5B.2
N$10
  Top 0.406: C8.1 49.53,44.45 R3.2
N$11
  Top 0.254: U7.1 60.01,40.83 59.31,40.13 59.31,38.23 60.01,37.53 R21.1
N$12
  Top 0.406: R7B.2 R7A.2
N$13
  Top 0.406: R10.2 67.5,43.56 Q2.3
PWR_SW  (via drill 0.4)
  Top 0.254: SW1.2 80.01,17.46 80.01,16 79.25,15.24 R19.1 78.17,15.05 77.47,14.35 v66.29,14.35 | U6.1 60.58,20.57 60.07,20.07 60.07,14.99 v60.71,14.35
  Bottom 0.254: v66.29,14.35 v60.71,14.35
PWRON
  Top 0.254: U6.15 63.83,28.77 65.28,30.23 65.28,41.15 64.07,42.36 R14.2
R_LED
  Top 0.254: U6.6 63.83,15.93 66.04,13.72 76.39,13.72 R16.1
RXD
  Top 0.254: U6.3 61.88,15.6 63.5,13.97 CN3.5
SCL
  Top 0.254: U4.7 69.72,37.97 CN2.3 67.18,35.43 67.18,31.11 68.58,29.72 68.58,26.73 R12.1 66.17,26.04 65.78,26.43 U6.12
SDA
  Top 0.254: U4.6 69.48,38.47 CN2.4 66.67,37.47 66.67,30.86 67.88,29.66 R13.1 67,27.05 U6.11
SWIM  (via drill 0.4)
  Top 0.254: U6.18 61.88,23.5 v61.85,23.5 | CN3.3 67.31,10.16 62.99,10.16 62.23,10.92 62.23,14.48 61.21,15.49 v61.21,19.56
  Bottom 0.254: v61.85,23.5 61.85,20.19 v61.21,19.56
TXD
  Top 0.254: U6.2 61.23,20.46 60.58,19.81 60.58,15.37 61.72,14.22 61.72,12.19 CN3.6
VBUS  (via drill 0.6)
  Top 0.406: R9.2 67.25,49.59 67.31,49.53 | D3.C 69.85,46.35 69.85,46.99 | R15.2 76.2,44.45
  Top 0.61: U5.2 U5.2@1 76.47,20.32
  Top 0.813: v78.23,41.53 v78.24,41.52 CN1.A9 81.03,41.52 81.53,41.02 81.53,38.99 81.03,38.48 CN1.B9 v78.23,38.48 | v78.23,38.48 | v78.23,38.48 77.1,37.35 R11.2 77.1,25.16 76.47,24.52 C31.1 76.47,20.32
  Top 1.778: Q1.3 66.92,49.92 67.31,49.53 69.85,46.99 74.93,46.99 76.2,45.72 76.2,44.45 76.2,42.55 77.22,41.53 v78.23,41.53
  Bottom 0.813: v78.23,41.53 v78.23,38.48
VBUS_SW
  Top 0.254: RS.1 54.61,41.27 54.86,41.02 57.53,41.02 58.1,41.59 U7.3
  pour Top (no thermals): 53.34,50.55 59.31,50.55 59.31,44.7 56.39,44.7 55.88,44.2 55.88,41.66 53.34,41.66
VIN
  Top 0.254: RS.2 54.61,40.01 54.86,40.26 57.53,40.26 58.1,39.69 U7.4
  pour Top (no thermals): 55.88,10.41 55.88,39.62 53.34,39.62 53.34,33.02 52.96,32.64 46.99,32.64 46.61,33.02 46.61,35.18 46.1,35.18 46.1,30.73 52.96,30.73 53.34,30.35 53.34,12.57 52.96,12.19 46.99,12.19 46.61,12.57 46.61,14.86 46.1,14.86 46.1,10.41

### Text on the board
tPlace: REV 3 | 5V ADJ | +5 | SDA | SCL | 3V3 | GND | GND | +12 | -12 | TX | RX | GND | SWIM | !RST | 3V3 | R | AmiCA USB PD PSU | G | Design By P Mulholland